# Altium schematic sheet 3_BMS.SchDoc
size A; SheetNumber: 4; SheetTotal: 5
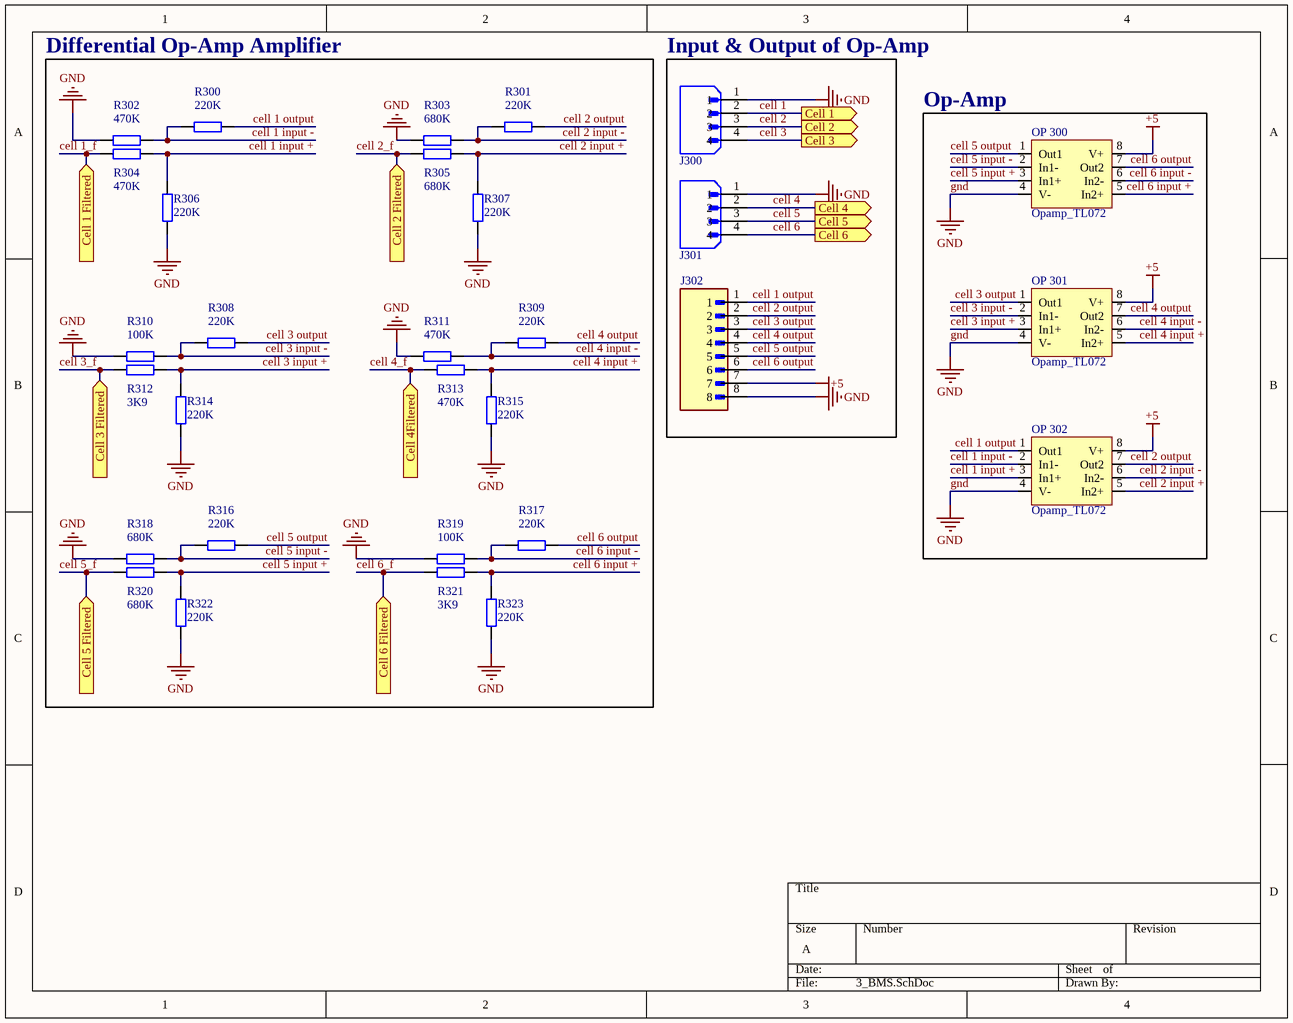
[diagram p0: 3_BMS.SchDoc]

## Parts
J300  S4B-XH-A-1  [JST_S4B-XH-A-1]  (value not drawn)
J301  S4B-XH-A-1  [JST_S4B-XH-A-1]  (value not drawn)
J302  S8B-XH-A-1  [JST_S8B-XH-A-1]  (value not drawn)
OP_300  Opamp_TL072  [TL072]
OP_301  Opamp_TL072  [TL072]
OP_302  Opamp_TL072  [TL072]
R300  220K  [RES_0603]
R301  220K  [RES_0603]
R302  470K  [RES_0805]
R303  680K  [RES_0603]
R304  470K  [RES_0805]
R305  680K  [RES_0603]
R306  220K  [RES_0603]
R307  220K  [RES_0603]
R308  220K  [RES_0603]
R309  220K  [RES_0603]
R310  100K  [RES_1206]
R311  470K  [RES_0805]
R312  3K9  [RES_0603]
R313  470K  [RES_0805]
R314  220K  [RES_0603]
R315  220K  [RES_0603]
R316  220K  [RES_0603]
R317  220K  [RES_0603]
R318  680K  [RES_0603]
R319  100K  [RES_1206]
R320  680K  [RES_0603]
R321  3K9  [RES_0603]
R322  220K  [RES_0603]
R323  220K  [RES_0603]

## Blocks framed on the sheet
Differential Op-Amp Amplifier: R300-R323
Input & Output of Op-Amp: J300-J302
Op-Amp: OP_300-OP_302

## Ports
Cell 1 (out, see 0_overview[3A], 4_Protection[1B]), Cell 1 Filtered (in, see 0_overview[2A], 4_Protection[3A]), Cell 2 (out, see 0_overview[3A], 4_Protection[1B]), Cell 2 Filtered (in, see 0_overview[2A]), Cell 3 (out, see 0_overview[3B], 4_Protection[1C]), Cell 3 Filtered (in, see 0_overview[2B]), Cell 4 (out, see 0_overview[3B], 4_Protection[2B]), Cell 4Filtered (in, see 0_overview[2B]), Cell 5 (out, see 0_overview[3B], 4_Protection[2B]), Cell 5 Filtered (in, see 0_overview[2B]), Cell 6 (out, see 0_overview[3B], 4_Protection[2C]), Cell 6 Filtered (in, see 0_overview[2B])

## Nets
+5: J302.7 OP_300.8(V+) OP_301.8(V+) OP_302.8(V+)
gnd: J300.1 J301.1 J302.8 OP_300.4(V-) OP_301.4(V-) OP_302.4(V-) R302.1 R303.2 R306.1 R307.1 R310.1 R311.1 R314.1 R315.1 R318.2 R319.1 R322.1 R323.1
cell 1: J300.2 ; port Cell 1
cell 1 input +: OP_302.3(In1+) R304.2 R306.2
cell 1 input -: OP_302.2(In1-) R300.1 R302.2
cell 1 output: J302.1 OP_302.1(Out1) R300.2
cell 1_f: R304.1 ; port Cell 1 Filtered
cell 2: J300.3 ; port Cell 2
cell 2 input +: OP_302.5(In2+) R305.1 R307.2
cell 2 input -: OP_302.6(In2-) R301.1 R303.1
cell 2 output: J302.2 OP_302.7(Out2) R301.2
cell 2_f: R305.2 ; port Cell 2 Filtered
cell 3: J300.4 ; port Cell 3
cell 3 input +: OP_301.3(In1+) R312.2 R314.2
cell 3 input -: OP_301.2(In1-) R308.1 R310.2
cell 3 output: J302.3 OP_301.1(Out1) R308.2
cell 3_f: R312.1 ; port Cell 3 Filtered
cell 4: J301.2 ; port Cell 4
cell 4 input +: OP_301.5(In2+) R313.2 R315.2
cell 4 input -: OP_301.6(In2-) R309.1 R311.2
cell 4 output: J302.4 OP_301.7(Out2) R309.2
cell 4_f: R313.1 ; port Cell 4Filtered
cell 5: J301.3 ; port Cell 5
cell 5 input +: OP_300.3(In1+) R320.1 R322.2
cell 5 input -: OP_300.2(In1-) R316.1 R318.1
cell 5 output: J302.5 OP_300.1(Out1) R316.2
cell 5_f: R320.2 ; port Cell 5 Filtered
cell 6: J301.4 ; port Cell 6
cell 6 input +: OP_300.5(In2+) R321.2 R323.2
cell 6 input -: OP_300.6(In2-) R317.1 R319.2
cell 6 output: J302.6 OP_300.7(Out2) R317.2
cell 6_f: R321.1 ; port Cell 6 Filtered

## Library data of the parts
J300 J301 = S4B-XH-A-1: Connector Header Through Hole, Right Angle 4 position 0.098 (2.50mm); MF: JST Sales; SnapEDA_Link: https://www.snapeda.com/parts/S4B-XH-A-1/JST+Sales+America+Inc./view-part/?ref=snap; Package: None; Value: *; MP: S4B-XH-A-1; Check_prices: https://www.snapeda.com/parts/S4B-XH-A-1/JST+Sales+America+Inc./view-part/?ref=eda
J302 = S8B-XH-A-1: Connector Header Through Hole, Right Angle 8 position 0.098 (2.50mm); MF: JST Sales; SnapEDA_Link: https://www.snapeda.com/parts/S8B-XH-A-1/JST+Sales+America+Inc./view-part/?ref=snap; Package: None; Value: *; MP: S8B-XH-A-1; Check_prices: https://www.snapeda.com/parts/S8B-XH-A-1/JST+Sales+America+Inc./view-part/?ref=eda
R300 R301 R303 R305-R309 R312 R314-R318 R320-R323 = RES_0603: Resistor SMD 0603; Manufacturer: *; Manufacturer Part Number: *; Distributor Link: *; LCSC: *
R302 R304 R311 R313 = RES_0805: Resistor SMD 0805; Manufacturer: *; Manufacturer Part Number: *; Distributor Link: *; LCSC: *
R310 R319 = RES_1206: Resistor SMD 1206; Manufacturer: *; Manufacturer Part Number: *; Distributor Link: *; LCSC: *